# EAGLE design NonComformingMainMatrix (EAGLE 9.1.1)
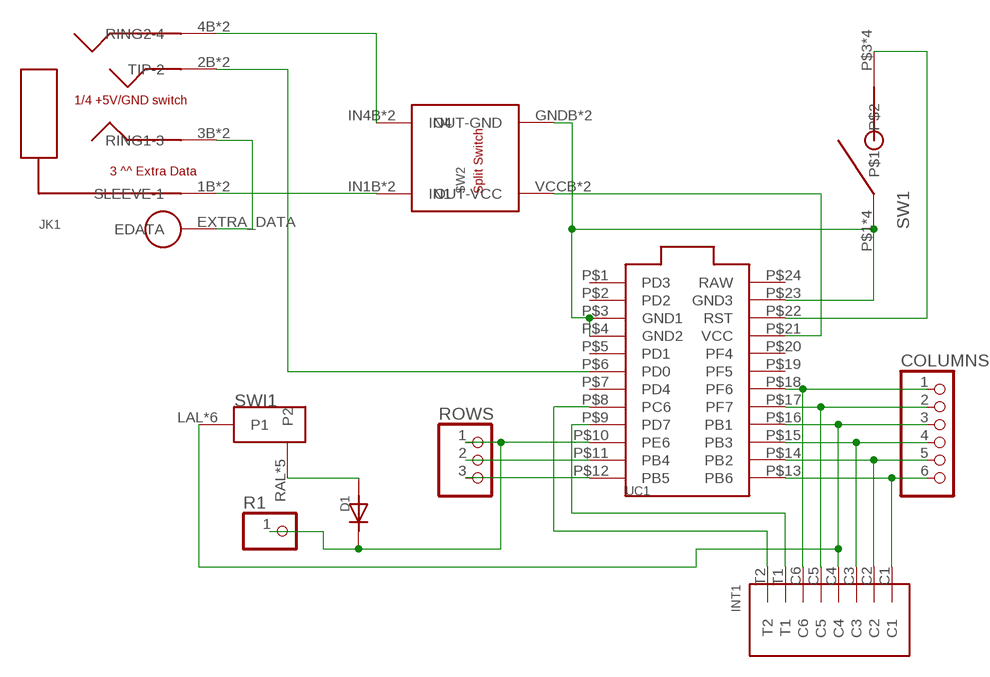
[diagram p0: schematic, sheet 1]

## Parts
COLUMNS  PINHD-1X6  [1X06]
D1  DIODE  [DIODE_COMBO]
INT1  INTRCNNT4X2  [INTRRIBBON]
JK1  TRRSJACKUNDER  [TRRSJACK]
R1  PINHD-1X1  [1X01]
ROWS  PINHD-1X3  [1X03]
SW1  RSTSWSMD  [FLATSWT]
SW2  TRANSFERPADDY  [TRANSFER_PADS]
SWI1  MX/ALPSDOUBLESIDED  [DOUBLED_MX/ALPS]
UC1  PROMICROUNDER  [PROMICRO_UNDER]

## Nets
N$1: ROWS.3 UC1.P$12(PB5)
N$2: ROWS.2 UC1.P$11(PB4)
N$3: D1.CATSB(CAT) D1.CATST(CAT) D1.CATT(CAT) R1.1 ROWS.1 UC1.P$10(PE6)
N$4: INT1.T1 UC1.P$9(PD7)
N$5: INT1.T2 UC1.P$8(PC6)
N$6: COLUMNS.6 INT1.C1 UC1.P$13(PB6)
N$7: COLUMNS.5 INT1.C2 UC1.P$14(PB2)
N$8: COLUMNS.4 INT1.C3 UC1.P$15(PB3)
N$9: COLUMNS.3 INT1.C4 SWI1.LAL(P1) SWI1.LAR(P1) SWI1.LCL(P1) SWI1.LCR(P1) SWI1.LLP(P1) SWI1.LRLP(P1) UC1.P$16(PB1)
N$10: COLUMNS.2 INT1.C5 UC1.P$17(PF7)
N$11: COLUMNS.1 INT1.C6 UC1.P$18(PF6)
N$12: SW1.P$1 SW1.P$2 SW1.P$5 SW1.P$6 SW2.GNDB(OUT-GND) SW2.GNDT(OUT-GND) UC1.P$3(GND1) UC1.P$4(GND2) UC1.P$23(GND3)
N$13: SW1.P$3 SW1.P$4 SW1.P$7 SW1.P$8 UC1.P$22(RST)
N$14: D1.ANOSB(AN) D1.ANOST(AN) D1.ANOT(AN) SWI1.RAL(P2) SWI1.RAR(P2) SWI1.RCL(P2) SWI1.RCR(P2) SWI1.RLMID(P2)
N$15: SW2.VCCB(OUT-VCC) SW2.VCCT(OUT-VCC) UC1.P$21(VCC)
N$16: JK1.4B(RING2-4) JK1.4T(RING2-4) SW2.IN4B(IN4) SW2.IN4T(IN4)
N$17: JK1.1B(SLEEVE-1) JK1.1T(SLEEVE-1) SW2.IN1B(IN1) SW2.IN1T(IN1)
N$18: JK1.3B(RING1-3) JK1.3T(RING1-3) JK1.EXTRA_DATA(EDATA)
N$19: JK1.2B(TIP-2) JK1.2T(TIP-2) UC1.P$6(PD0)
Unconnected: UC1.P$1(PD3) UC1.P$2(PD2) UC1.P$5(PD1) UC1.P$7(PD4) UC1.P$19(PF5) UC1.P$20(PF4) UC1.P$24(RAW)

## Library data of the parts
COLUMNS = pinhead:PINHD-1X6: PIN HEADER
D1 = Keys:DIODE
INT1 = Keys:INTRCNNT
JK1 = Keys:TRRSJACK
R1 = pinhead:PINHD-1X1: PIN HEADER
ROWS = pinhead:PINHD-1X3: PIN HEADER
SW1 = Keys:RSTSW
SW2 = Keys:TRANSFER
SWI1 = Keys:MX/ALPS
UC1 = Keys:PROMICRO

## Board
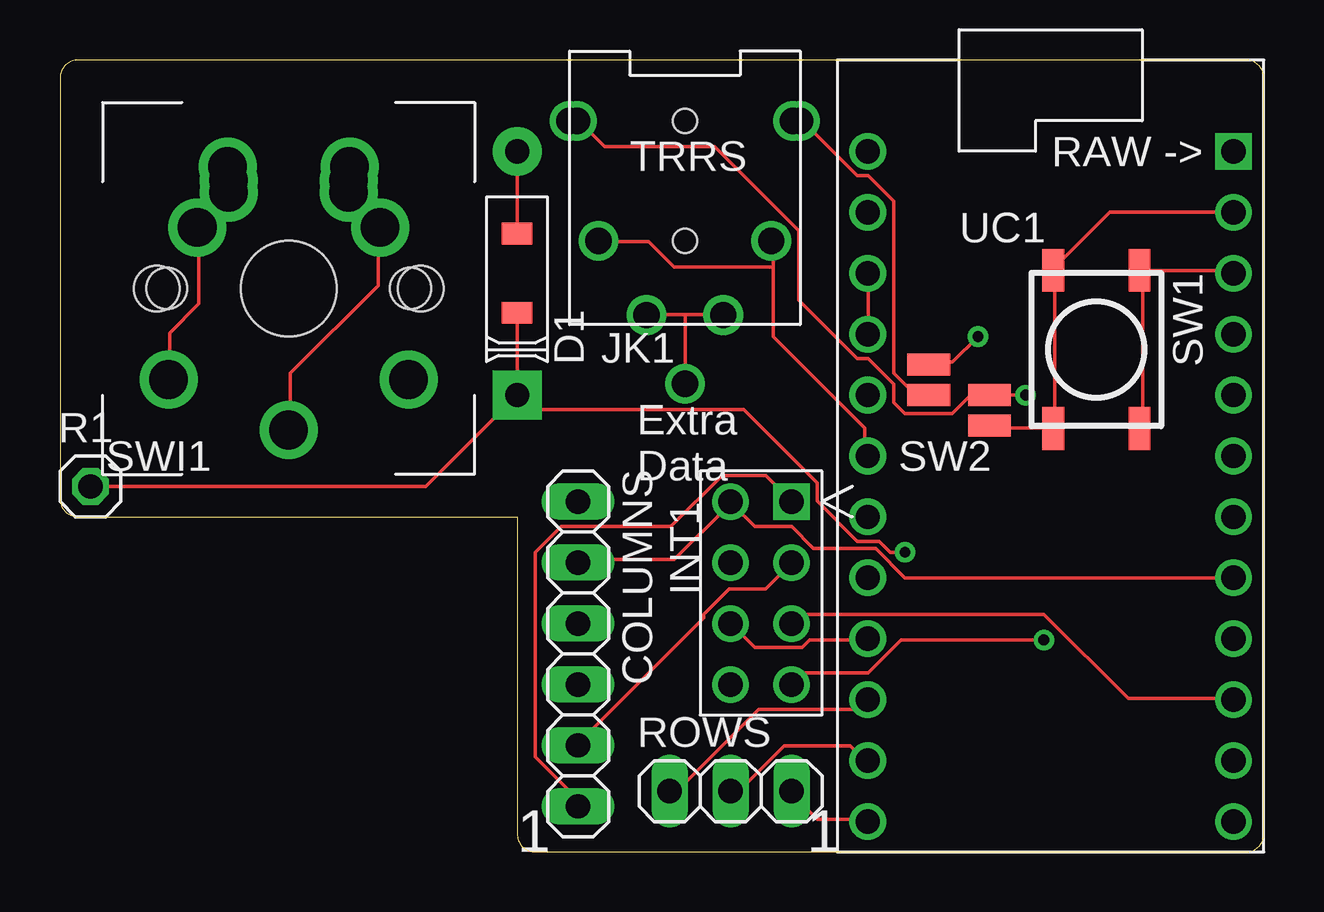
[diagram p1: board, top side]
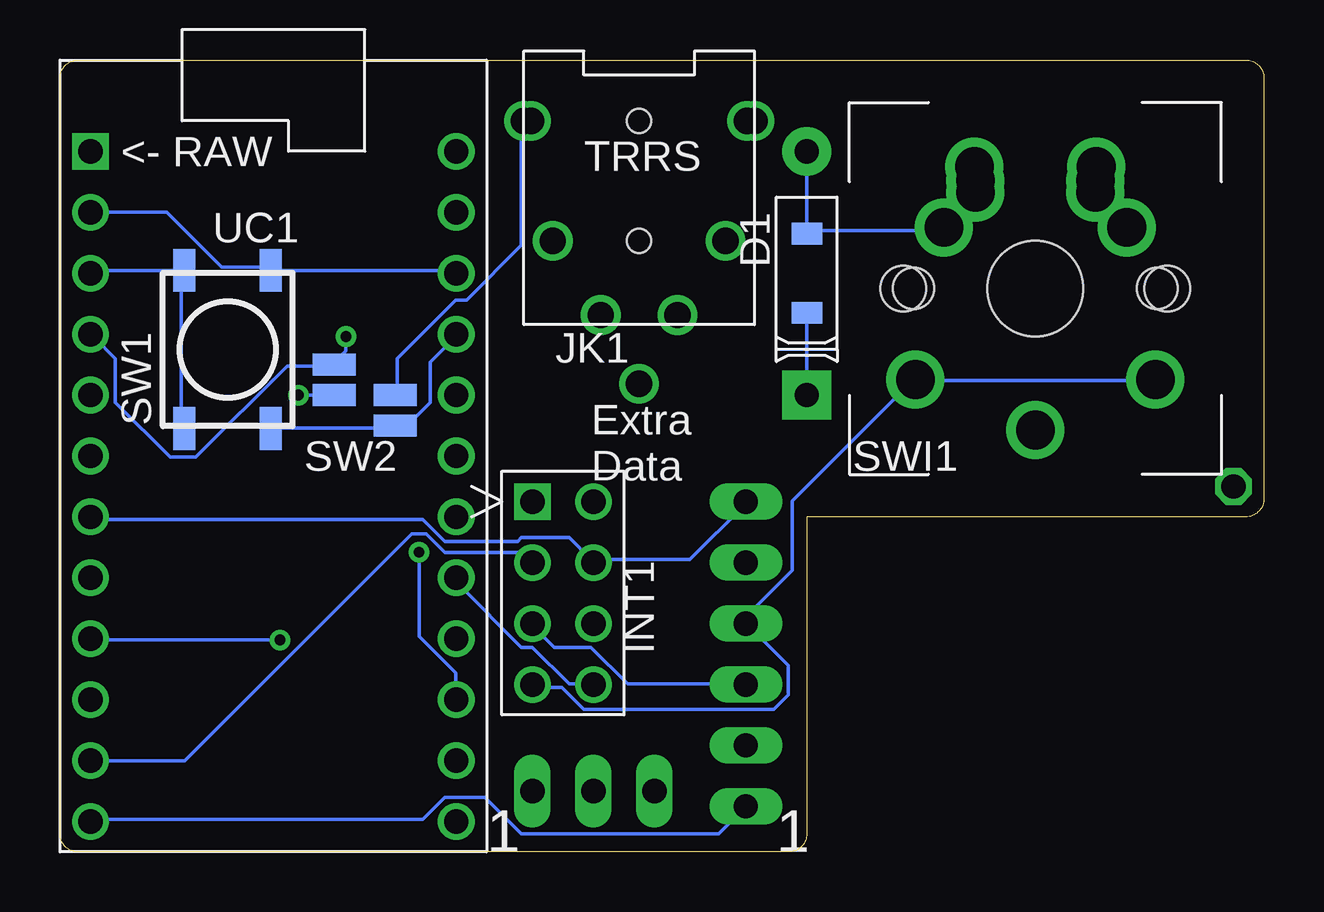
[diagram p2: board, bottom side, seen from below]

Size 50.16 x 33.02 mm. Coordinates in mm from the lower left corner, seen from the top.
Outline: 19.05,13.97 19.05,0.76 arc90 19.81,0 49.4,0 arc90 50.16,0.76 50.16,32.26 arc90 49.4,33.02 0.76,33.02 arc90 0,32.26 0,14.73 arc90 0.76,13.97 19.05,13.97
Copper layers (1*16): Top 0.035mm / dielectric 1.5mm / Bottom 0.035mm
Design rules "Sierra": minimum track width 6mil, minimum drill 0.45mm, track to track 6mil, track to pad 6mil, pad to pad 6mil, via to via 6mil, smd to smd 6mil, copper to edge 0.4mm, drill to drill 10mil, minimum pad ring 10mil, minimum via ring 8mil, stop-mask expansion 4mil, vias tented up to drill 0mil, thermal gap 10mil

### Footprints (pad centres in the part's own frame; a part is rotated, then mirrored left to right if it is on the bottom)
1X06 = drill 1.016 long: 1 -6.35,0; 2 -3.81,0; 3 -1.27,0; 4 1.27,0; 5 3.81,0; 6 6.35,0
DIODE_COMBO = smd 0.914 x 1.27 bottom: ANOSB 1.651,0; CATSB -1.651,0 | smd 0.914 x 1.27: ANOST 1.651,0; CATST -1.651,0 | drill 1.016 pad 2.032: ANOT 5.08,0 | drill 1.016 pad 2.032 square: CATT -5.08,0
INTRRIBBON = drill 1.016 square: C1 0,0 | drill 1.016: C2 2.54,0; C3 5.08,0; C4 7.62,0; C5 0,-2.54; C6 2.54,-2.54; T1 5.08,-2.54; T2 7.62,-2.54
TRRSJACK = drill 1.1: 1B 4.5,-1.9; 1T 4.8,-1.9; 2B 3.6,-6.9; 2T -3.6,-6.9; 3B -1.6,-10; 3T 1.6,-10; 4B -4.8,-1.9; 4T -4.5,-1.9; EXTRA_DATA 0,-12.87 | hole 1: 0,-1.9; 0,-6.9
1X01 = drill 1.016 octagon: 1 0,0
1X03 = drill 1.016 long: 1 -2.54,0; 2 0,0; 3 2.54,0
FLATSWT = smd 1.778 x 0.914: P$1 -3.3,-1.8; P$2 3.3,-1.8; P$3 -3.3,1.8; P$4 3.3,1.8 | smd 1.778 x 0.914 bottom: P$5 -3.3,-1.8; P$6 3.3,-1.8; P$7 -3.3,1.8; P$8 3.3,1.8
TRANSFER_PADS = smd 1.778 x 0.914 bottom: GNDB -1.27,-1.27; IN1B -1.27,0; IN4B 1.27,0; VCCB 1.27,1.27 | smd 1.778 x 0.914: GNDT 1.27,-1.27; IN1T -1.27,0; IN4T 1.27,0; VCCT -1.27,1.27
DOUBLED_MX/ALPS = drill 1.613: LAL -2.5,4; LAR -2.5,4.5; LCL -3.81,2.54; LCR -2.54,5.08; LLP -5,-3.8; LRLP 5,-3.8; RAL 2.5,4; RAR 2.5,4.5; RCL 3.81,2.54; RCR 2.54,5.08; RLMID 0,-5.9 | hole 3.988: 0,0 | hole 1.702: -5.08,0; 5.08,0 | hole 1.9: -5.5,0; 5.5,0
PROMICRO_UNDER = drill 1.016: P$1 -7.62,0; P$2 -7.62,-2.54; P$3 -7.62,-5.08; P$4 -7.62,-7.62; P$5 -7.62,-10.16; P$6 -7.62,-12.7; P$7 -7.62,-15.24; P$8 -7.62,-17.78; P$9 -7.62,-20.32; P$10 -7.62,-22.86; P$11 -7.62,-25.4; P$12 -7.62,-27.94; P$13 7.62,-27.94; P$14 7.62,-25.4; P$15 7.62,-22.86; P$16 7.62,-20.32; P$17 7.62,-17.78; P$18 7.62,-15.24; P$19 7.62,-12.7; P$20 7.62,-10.16; P$21 7.62,-7.62; P$22 7.62,-5.08; P$23 7.62,-2.54 | drill 1.016 square: P$24 7.62,0

### Placement (x,y rotation side)
COLUMNS  21.59,8.26 270 top
D1  19.05,24.13 90 top
INT1  30.48,14.61 270 top
JK1  26.04,32.38 0 top
R1  1.27,15.24 0 top
ROWS  27.94,2.54 0 top
SW1  43.18,20.95 270 top
SW2  37.47,19.05 0 top
SWI1  9.53,23.5 0 top
UC1  41.27,29.21 0 top

### Tracks (layer width: path | path; a pad name or v marks a point on that pad's centre or on a via)
N$1
  Top 0.152: UC1.P$12 33.53,1.37 31.55,1.37 30.48,2.44 ROWS.3
N$2
  Top 0.152: ROWS.2 28.04,2.59 28.35,2.59 30.18,4.42 32.92,4.42 33.53,3.81 UC1.P$11
N$3  (via drill 0.45)
  Top 0.152: ROWS.1 25.45,2.59 25.76,2.59 29.11,5.94 33.22,5.94 33.53,6.25 UC1.P$10 | D1.CATT 19.05,22.4 D1.CATSB | D1.CATT 15.24,15.24 1.37,15.24 R1.1 | v35.2,12.5 34.59,12.5 34.14,12.95 33.22,12.95 31.55,14.63 31.55,15.39 28.5,18.44 19.66,18.44 D1.CATT
  Bottom 0.152: D1.CATT 19.05,22.4 D1.CATSB | v35.2,12.5 35.2,8.99 33.68,7.47 33.68,6.4 UC1.P$10
N$4
  Top 0.152: UC1.P$9 33.53,8.84 31.24,8.84 30.94,8.53 28.96,8.53 28.04,9.45 INT1.T1
N$5
  Bottom 0.152: INT1.T2 28.04,7.01 28.96,7.01 30.48,8.53 30.94,8.53 33.53,11.12 33.53,11.43 UC1.P$8
N$6
  Top 0.152: COLUMNS.6 21.49,1.98 21.49,2.29 19.81,3.96 19.81,12.5 20.88,13.56 25.45,13.56 27.58,15.7 29.41,15.7 30.48,14.63 INT1.C1
  Bottom 0.152: UC1.P$13 48.77,1.37 35.05,1.37 34.14,2.29 32.46,2.29 30.94,0.76 22.71,0.76 21.64,1.83 COLUMNS.6
N$7
  Top 0.152: COLUMNS.5 21.64,4.57 26.82,9.75 26.82,9.91 27.89,10.97 29.41,10.97 30.48,12.04 INT1.C2
  Bottom 0.152: UC1.P$14 48.77,3.81 44.96,3.81 35.51,13.26 34.9,13.26 34.14,12.5 30.79,12.5 30.48,12.19 INT1.C2
N$8
  Top 0.152: UC1.P$15 48.77,6.4 44.5,6.4 41,9.91 30.79,9.91 30.48,9.6 INT1.C3
  Bottom 0.152: COLUMNS.4 21.64,7.01 26.52,7.01 28.04,8.53 29.57,8.53 30.48,9.45 INT1.C3
N$9  (via drill 0.45)
  Top 0.152: SWI1.LAR 7.16,27.89 7.16,27.58 SWI1.LAL 7.01,28.04 7.01,28.5 SWI1.LCR 7.01,27.43 5.64,26.06 SWI1.LCL 5.79,25.91 5.79,22.86 4.57,21.64 4.57,19.81 SWI1.LLP | v41,8.84 35.05,8.84 33.68,7.47 30.94,7.47 30.48,7.01 INT1.C4
  Bottom 0.152: INT1.C4 30.48,6.86 29.26,6.86 28.35,5.94 20.42,5.94 19.81,6.55 19.81,7.77 21.49,9.45 COLUMNS.3 21.49,9.6 21.49,9.91 19.66,11.73 19.66,14.63 14.63,19.66 SWI1.LRLP 14.48,19.66 4.57,19.66 SWI1.LLP | v41,8.84 48.77,8.84 UC1.P$16
N$10
  Top 0.152: COLUMNS.2 21.64,12.19 25.6,12.19 27.89,14.48 INT1.C5 28.04,14.48 28.96,13.56 30.48,13.56 31.39,12.65 33.98,12.65 35.2,11.43 48.77,11.43 UC1.P$17
N$11
  Bottom 0.152: COLUMNS.1 21.64,14.48 23.93,12.19 27.89,12.19 INT1.C6 28.04,12.19 28.96,13.11 30.94,13.11 31.09,12.95 34.14,12.95 35.05,13.87 48.77,13.87 UC1.P$18
N$12
  Top 0.152: UC1.P$4 33.68,21.64 33.68,24.08 UC1.P$3 | SW2.GNDT 38.86,17.68 41.3,17.68 SW1.P$6 41.45,17.68 41.45,24.23 SW1.P$5 41.45,24.38 43.74,26.67 48.77,26.67 UC1.P$23
  Bottom 0.152: SW1.P$6 41.3,17.68 36.27,17.68 SW2.GNDB 36.12,17.83 35.66,17.83 34.75,18.75 34.75,20.42 33.68,21.49 UC1.P$4 | UC1.P$3 33.68,24.23 41.3,24.23 SW1.P$5 41.45,24.38 43.43,24.38 45.72,26.67 48.77,26.67 UC1.P$23
N$13
  Top 0.152: 45.11,24.23 45.11,17.68 SW1.P$8 | 45.11,24.23 SW1.P$7 45.11,24.23 | 45.11,24.23 48.77,24.23 UC1.P$22
  Bottom 0.152: 45.11,24.23 45.11,17.68 SW1.P$8 | 45.11,24.23 SW1.P$7 45.11,24.23 | 45.11,24.23 48.77,24.23 UC1.P$22
N$14
  Top 0.152: SWI1.RCR 12.04,27.89 12.04,27.58 SWI1.RAL 12.04,28.04 SWI1.RAR 12.04,27.43 13.41,26.06 SWI1.RCL 13.26,25.91 13.26,23.62 9.6,19.96 9.6,17.68 SWI1.RLMID | D1.ANOST 19.05,25.91 19.05,29.11 D1.ANOT
  Bottom 0.152: 19.05,25.91 19.05,29.11 D1.ANOT | 19.05,25.91 D1.ANOST 19.05,25.91 | 19.05,25.91 13.41,25.91 SWI1.RCL
N$15  (via drill 0.45)
  Top 0.152: v38.25,21.49 37.19,20.42 36.27,20.42 SW2.VCCT
  Bottom 0.152: v38.25,21.49 38.25,20.88 38.71,20.42 SW2.VCCB 38.86,20.27 40.69,20.27 44.5,16.46 45.57,16.46 47.85,18.75 47.85,20.57 48.77,21.49 UC1.P$21
N$16  (via drill 0.45)
  Top 0.152: v40.23,19.05 38.86,19.05 SW2.IN4T 38.71,19.05 37.95,19.05 37.19,18.29 35.2,18.29 34.75,18.75 34.75,19.51 33.68,20.57 33.22,20.57 30.79,23.01 30.79,25.91 27.28,29.41 22.71,29.41 21.64,30.48 JK1.4T 21.49,30.48 21.34,30.48 JK1.4B
  Bottom 0.152: v40.23,19.05 38.86,19.05 SW2.IN4T
N$17
  Top 0.152: SW2.IN1T 36.12,19.05 35.66,19.05 34.75,19.96 34.75,27.13 33.68,28.19 33.22,28.19 30.94,30.48 JK1.1T 30.79,30.48 30.63,30.48 JK1.1B
  Bottom 0.152: SW2.IN1T 36.12,19.05 36.12,20.57 33.68,23.01 33.22,23.01 30.94,25.3 30.94,30.48 JK1.1T
N$18
  Top 0.152: 26.06,22.4 27.58,22.4 JK1.3T | 26.06,22.4 24.54,22.4 JK1.3B | 26.06,22.4 26.06,19.66 JK1.EXTRA_DATA
N$19
  Top 0.152: 29.72,24.38 29.72,25.45 JK1.2B | 29.72,24.38 29.72,21.49 33.53,17.68 33.53,16.61 UC1.P$6 | 29.72,24.38 25.6,24.38 24.54,25.45 22.55,25.45 JK1.2T

### Text on the board
tPlace: 1 | 1
bPlace: 1 | 1